# Altium schematic sheet EMMC.SchDoc
size A4; SheetNumber: 7; SheetTotal: 8
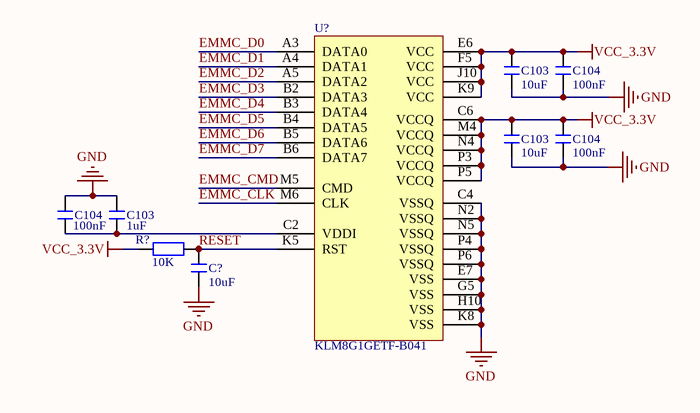
[diagram p0: EMMC.SchDoc]

## Parts
(Parts that share a designator on the sheet are numbered #1, #2 ... from top to bottom, then left to right.)
C103#1  10uF  [C 0603]
C103#2  10uF  [C 0603]
C103#3  1uF  [C 0603]
C104#1  100nF  [C 0402]
C104#2  100nF  [C 0402]
C104#3  100nF  [C 0402]
C?  10uF  [C 0402]
R?  10K  [R 0402]
U?  KLM8G1GETF-B041  [BGA153  EMMC]

## Nets
GND: C103#1.1 C103#2.1 C103#3.1 C104#1.1 C104#2.1 C104#3.1 C?.1 U?.C4(VSSQ) U?.E7(VSS) U?.G5(VSS) U?.H10(VSS) U?.K8(VSS) U?.N2(VSSQ) U?.N5(VSSQ) U?.P4(VSSQ) U?.P6(VSSQ)
VCC_3.3V: C103#1.2 C103#2.2 C104#1.2 C104#2.2 R?.1 U?.C6(VCCQ) U?.E6(VCC) U?.F5(VCC) U?.J10(VCC) U?.K9(VCC) U?.M4(VCCQ) U?.N4(VCCQ) U?.P3(VCCQ) U?.P5(VCCQ)
EMMC_CLK: U?.M6(CLK)
EMMC_CMD: U?.M5(CMD)
EMMC_D0: U?.A3(DATA0)
EMMC_D1: U?.A4(DATA1)
EMMC_D2: U?.A5(DATA2)
EMMC_D3: U?.B2(DATA3)
EMMC_D4: U?.B3(DATA4)
EMMC_D5: U?.B4(DATA5)
EMMC_D6: U?.B5(DATA6)
EMMC_D7: U?.B6(DATA7)
RESET: C?.2 R?.2 U?.K5(RST)
NetC103#3_2: C103#3.2 C104#3.2 U?.C2(VDDI)

## Library data of the parts
C103#1-C103#3 C104#1-C104#3 C? = C: 无极性贴片电容; 版权归属: 正点原子; BOM名称: 无极性贴片电容; 学习资源: www.openedv.com
R? = R: 贴片电阻; 版权归属: 正点原子; BOM名称: 贴片电阻; 学习资源: www.openedv.com
U? = KLM8G1GETF-B041: 8GB EMMC存储芯片